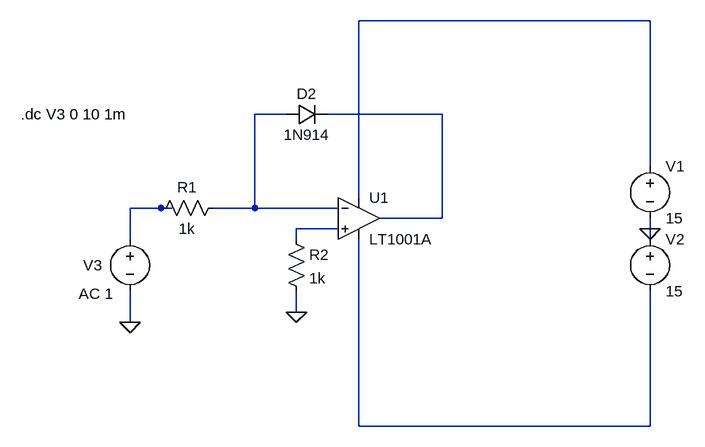
[diagram p0: schematic LogAmp.asc]
LogAmp.asc, the LTspice schematic file:
Version 4
SHEET 1 880 680
WIRE 768 -192 320 -192
WIRE 208 -48 160 -48
WIRE 448 -48 272 -48
WIRE 768 32 768 -192
WIRE 320 80 320 -192
WIRE 16 96 -32 96
WIRE 32 96 16 96
WIRE 160 96 160 -48
WIRE 160 96 96 96
WIRE 288 96 160 96
WIRE 448 112 448 -48
WIRE 448 112 352 112
WIRE 288 128 224 128
WIRE 768 128 768 112
WIRE -32 144 -32 96
WIRE 224 144 224 128
WIRE 768 144 768 128
WIRE 224 256 224 224
WIRE -32 272 -32 224
WIRE 320 432 320 144
WIRE 768 432 768 224
WIRE 768 432 320 432
FLAG -32 272 0
FLAG 768 128 0
FLAG 224 256 0
SYMBOL voltage 768 16 R0
WINDOW 123 0 0 Left 2
WINDOW 39 0 0 Left 2
SYMATTR InstName V1
SYMATTR Value 15
SYMBOL voltage 768 128 R0
WINDOW 123 0 0 Left 2
WINDOW 39 0 0 Left 2
SYMATTR InstName V2
SYMATTR Value 15
SYMBOL Opamps\\LT1001A 320 48 R0
SYMATTR InstName U1
SYMBOL voltage -32 128 R0
WINDOW 0 -72 56 Left 2
WINDOW 3 -301 -26 Invisible 2
WINDOW 123 -79 100 Left 2
WINDOW 39 0 0 Left 2
SYMATTR InstName V3
SYMATTR Value 1
SYMATTR Value2 AC 1
SYMBOL res 208 128 R0
SYMATTR InstName R2
SYMATTR Value 1k
SYMBOL diode 208 -32 R270
WINDOW 0 32 32 VTop 2
WINDOW 3 0 32 VBottom 2
SYMATTR InstName D2
SYMATTR Value 1N914
SYMBOL res 112 80 R90
WINDOW 0 0 56 VBottom 2
WINDOW 3 32 56 VTop 2
SYMATTR InstName R1
SYMATTR Value 1k
TEXT -200 -48 Left 2 !.dc V3 0 10 1m

The netlist it stands for:
* LogAmp.asc
V1 N001 0 15
V2 0 N006 15
XU1 N005 N002 N001 N006 N003 LT1001  ; LT1001A, pins In+ In- V+ V- OUT
V3 N004 0 1 AC 1
R2 N005 0 1k
D2 N002 N003 1N914
R1 N002 N004 1k
.model D D
.lib standard.dio
.dc V3 0 10 1m
.lib LTC.lib
.backanno
.end